# EasyEDA Pro project AquaEye = 2025-10-07.epro

# Schematic Schematic
Board Name: ESP32-C3 - Proteção Gemini; Create Date: 2025-09-07; Page Name: 1x TPS2553; Project Name: AquaEye-Novo; Schematic Name: Schematic-ProtGemini; Update Date: 2025-10-05; Company: EasyEDA.com; Drawn: EasyEDA; Page Size: A4; Part Number: JLCPCB-002; Reviewed: EasyEDA; Version: V0.1
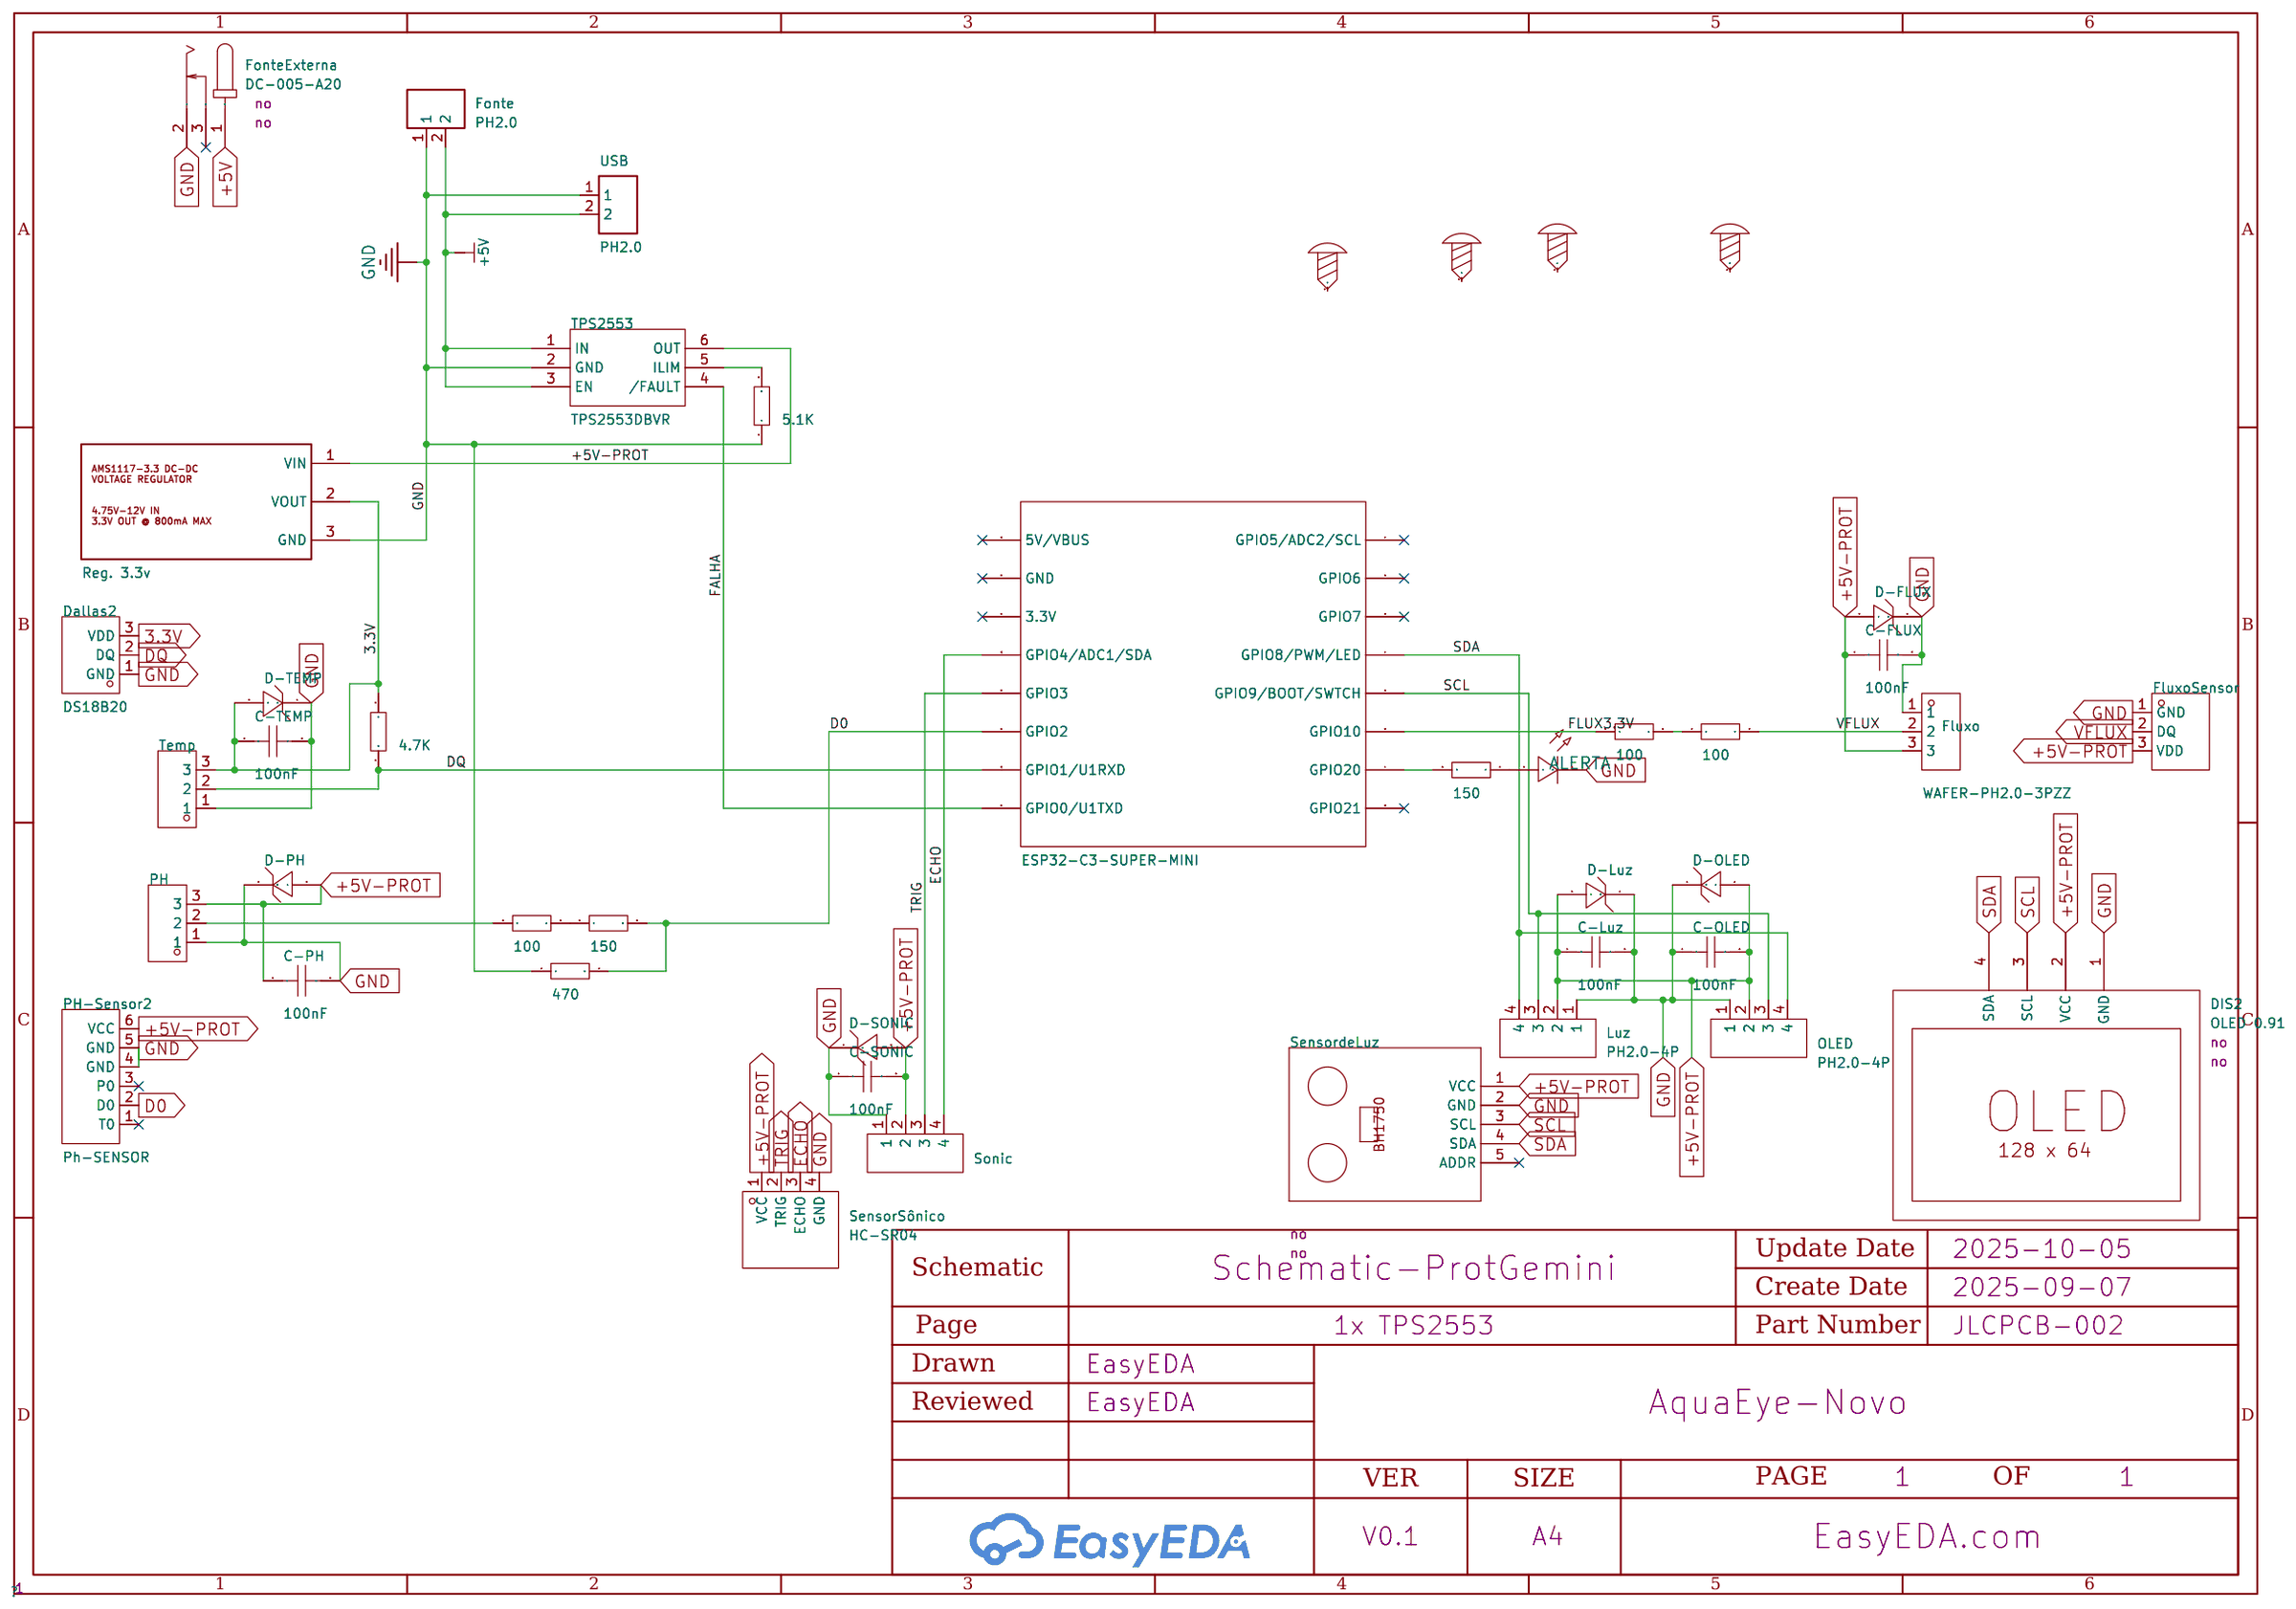
[diagram p0: schematic sheet]

## Parts
ALERTA  -  [LED0805-R-RD]
C-FLUX  100nF  [CAP-TH_L6.5-W4.0-P5.00-D0.6-S1.20]
C-Luz  100nF  [CAP-TH_L6.5-W4.0-P5.00-D0.6-S1.20]
C-OLED  100nF  [CAP-TH_L6.5-W4.0-P5.00-D0.6-S1.20]
C-PH  100nF  [CAP-TH_L6.5-W4.0-P5.00-D0.6-S1.20]
C-SONIC  100nF  [CAP-TH_L6.5-W4.0-P5.00-D0.6-S1.20]
C-TEMP  100nF  [CAP-TH_L6.5-W4.0-P5.00-D0.6-S1.20]
D-FLUX  SMAJ5.0A  [SMA_L4.3-W2.6-LS5.2-RD]
D-Luz  SMAJ5.0A  [SMA_L4.3-W2.6-LS5.2-RD]
D-OLED  SMAJ5.0A  [SMA_L4.3-W2.6-LS5.2-RD]
D-PH  SMAJ5.0A  [SMA_L4.3-W2.6-LS5.2-RD]
D-SONIC  SMAJ5.0A  [SMA_L4.3-W2.6-LS5.2-RD]
D-TEMP  SMAJ5.0A  [SMA_L4.3-W2.6-LS5.2-RD]
Dallas2  DS18B20  [TO-92-3_L4.9-W3.7-P1.27-L]  (no BOM)
DIS2  OLED 0.91  [I2C OLED 0.91]  (no BOM)
Fluxo  WAFER-PH2.0-3PZZ  [CONN-TH_PH2.0D-L-3P]
FluxoSensor  DS18B20A10T6  [TO-92-SMD_L4.6-W4.6-P1.27_DS18B20]  (no BOM)
Fonte  PH2.0  [CONN-TH_WAFER-PH2.0-2PZZ-Y62]
FonteExterna  DC-005-A20  [DC-IN-TH_DC-005-A200]  (no BOM)
Luz  PH2.0-4P  [CONN-TH_PH2.0-4P]
M1  Reg. 3.3v  [AMS1117-3.3 BUCK CONVERTER BREAKOUT]
OLED  PH2.0-4P  [CONN-TH_PH2.0-4P]
PH  WAFER-PH2.0-3PZZ  [CONN-TH_PH2.0D-L-3P]
PH-Sensor2  Ph-SENSOR  [PHSENSOR]  (no BOM)
R5  100  [R0603]
R7  100  [R0603]
R8  150  [R0603]
R9  470  [R0603]
R10  100  [R0603]
SCREW1  -  [Screw-Hole-M2]
SCREW2  -  [Screw-Hole-M2]
SCREW3  -  [Screw-Hole-M2]
SCREW4  -  [Screw-Hole-M2]
SensordeLuz  -  [LIGHT-SENSOR-BH1750]  (no BOM)
SensorSônico  HC-SR04  [TH_HC-SR04V]  (no BOM)
Sonic  PH2.0-4P  [CONN-TH_PH2.0-4P]
Temp  WAFER-PH2.0-3PZZ  [CONN-TH_PH2.0D-L-3P]
TPS2553  TPS2553DBVR  [SOT-23-6_L2.9-W1.6-P0.95-LS2.8-BR]
U1  4.7K  [R0603]
U2  ESP32-C3-SUPER-MINI  [ESP32-C3-SUPER-MINI]
U3  5.1K  [R0603]
U4  150  [R0603]
USB  PH2.0  [CONN-TH_WAFER-PH2.0-2PZZ-Y62]

## Library data of the parts
ALERTA = LED_0805-R: Supplier Footprint: 0805
C-FLUX C-Luz C-OLED C-PH C-SONIC C-TEMP = DCS104Z26Y5VF6FJ5A0: Capacitance:100nF Tolerance:-20%~+80% Tolerance:-20%~+80% Voltage Rating:50V Pin Spacing:5mm Temperature Coefficient:Y5V; LCSC Part Name: 100nF -20%~+80% 50V; Supplier Part: C2896071; Manufacturer: SHM(南方宏明); Supplier Footprint: 插件,P=5mm; JLCPCB Part Class: Extended Part; Datasheet: https://item.szlcsc.com/datasheet/DCS104Z26Y5VF6FJ5A0/3138620.html; Supplier: LCSC; Tolerance: -20%~+80%; Voltage Rating: 50V; Pin Spacing: 5mm; Temperature Coefficient: Y5V
D-FLUX D-Luz D-OLED D-PH D-SONIC D-TEMP = SMAJ5.0A: Reverse Stand-Off Voltage (Vrwm):5V Maximum Clamping Voltage:9.2V Peak Pulse Current (Ipp)@10/1000us:43.5A Breakdown Voltage:6.4V Type:TVS; LCSC Part Name: 单向TVS 5V截止 43.5A峰值脉冲; Supplier Part: C132575; Supplier Footprint: SMA(DO-214AC); Datasheet: https://atta.szlcsc.com/upload/public/pdf/source/20180726/C236400_045E05B60F075B360360EE470465B436.pdf; Supplier: LCSC; Reverse Stand-Off Voltage (Vrwm): 5V; Maximum Clamping Voltage: 9.2V; Peak Pulse Current (Ipp)@10/1000us: 43.5A; Breakdown Voltage: 6.4V; Type: TVS
Dallas2 = DS18B20: Temperature range:-55℃~+125℃ Temperature range:-55℃~+125℃ Resolution:±0.4℃ Resolution:±0.4℃ Supply Voltage:3V~5.5V Supply Voltage:3V~5.5V Standby Current:- Interface Type:-; Supplier Part: C376006; Manufacturer: UMW(友台半导体); Supplier Footprint: TO-92; JLCPCB Part Class: Extended Part; Datasheet: https://atta.szlcsc.com/upload/public/pdf/source/20231109/DC3DA9D47D486EF40A6E0F08B9A498E3.pdf; Supplier: LCSC; Temperature range: -55℃~+125℃; Resolution: ±0.4℃; Supply Voltage: 3V~5.5V; Check: false
DIS2 = OLED 0.91: Manufacturer Part: SSD1306 I2C OLED
Fluxo Temp = WAFER-PH2.0-3PZZ: Pins Structure:1x3P Pitch:2mm Mounting Type:Direct Insert Reference Series:PH Number of Pins:3P Number of Rows:1 Number of PINs Per Row:3 Row Spacing:- Current Rating:2A Contact Material:Brass Contact Plating:Tin Operating Temperature:-25℃~+85℃ Operating; Manufacturer: XUNPU(讯普); Supplier: LCSC; Supplier Part: C5359600; LCSC Part Name: 1x3P 间距:2mm 直插 系列:PH; Supplier Footprint: 插件,P=2mm; JLCPCB Part Class: Extended Part; Datasheet: https://atta.szlcsc.com/upload/public/pdf/source/20241108/09B74E94153224768C62B7F095CB8C18.pdf; Pins Structure: 1x3P; Pitch: 2mm; Mounting Type: Direct Insert; Reference Series: PH; Number of Pins: 3P; Number of Rows: 1; Number of PINs Per Row: 3; Current Rating: 2A; Contact Material: Brass; Contact Plating: Tin; Operating Temperature: -25℃~+85℃; Voltage Rating: 250V; Plastic Material: PA66; Flame Retardant Rating: UL94V-0; Color: White; Z-Height of the Board: 6.05mm; X-Length of Bottom Edge on Board (Spacing Line): 8mm; Y-Width of Bottom Edge on Board: 4.7mm
FluxoSensor = DS18B20A10T6: Temperature range:-55℃~+125℃ Temperature range:-55℃~+125℃ Resolution:±0.5℃ Resolution:±0.5℃ Supply Voltage:1.8V~5.5V Supply Voltage:1.8V~5.5V Standby Current:0.2uA Interface Type:-; LCSC Part Name: 数字温度探头; Supplier Part: C22360667; Manufacturer: Mysentech(敏源传感); JLCPCB Part Class: Extended Part; Datasheet: https://atta.szlcsc.com/upload/public/pdf/source/20240403/8816A34B1D539D1E85165E3122908D9D.pdf; Supplier: LCSC; Temperature range: -55℃~+125℃; Resolution: ±0.5℃; Supply Voltage: 1.8V~5.5V; Standby Current: 0.2uA; Check: false
Fonte USB = PH2.0: Supplier: LCSC; Supplier Part: C42441157; Manufacturer: XUNPU(讯普); Manufacturer Part: WAFER-PH2.0-2PZZ-Y62
FonteExterna = DC-005-A20: Connector Type:DC Power Receptacle Mounting Style:- Inside Contact Diameter:2mm Outside Contact Diameter:6.4mm Current Rating (Max):- Voltage Rating (Max):- Contact Material:- Contact Plating:- Operating Temperature Range:- Operating Temperature Range:- S; LCSC Part Name: DC电源插座 内径:2mm 外径:6.4mm; Supplier Part: C19077752; Manufacturer: Yuandi(元迪); Supplier Footprint: 插件; JLCPCB Part Class: Extended Part; Datasheet: https://atta.szlcsc.com/upload/public/pdf/source/20231020/7887492F275154E63F689B1C5AE32492.pdf; Supplier: LCSC; Connector Type: DC Power Receptacle; Inside Contact Diameter: 2mm; Outside Contact Diameter: 6.4mm
Luz OLED Sonic = PH2.0-4P: Supplier: LCSC; Supplier Part: C722763; Manufacturer: CAX(创都); JLCPCB Part Class: Extended Part
M1 = AMS1117-3.3 DC-DC Voltage Regulator: Supplier: DollaTek on Amazon; link: https://www.amazon.co.uk/gp/product/B07PQPGMZ2/ref=ppx_yo_dt_b_asin_image_o01_s00?ie=UTF8&psc=1
PH = WAFER-PH2.0-3PZZ: Pins Structure:1x3P Pitch:2mm Mounting Type:Direct Insert Reference Series:PH Number of Pins:3P Number of Rows:1 Number of PINs Per Row:3 Row Spacing:- Current Rating:2A Contact Material:Brass Contact Plating:Tin Operating Temperature:-25℃~+85℃ Operating; Manufacturer: XUNPU(讯普); Supplier: LCSC; Supplier Part: C5359600; LCSC Part Name: 1x3P 间距:2mm 直插 系列:PH; Supplier Footprint: 插件,P=2mm; JLCPCB Part Class: Extended Part; Datasheet: https://atta.szlcsc.com/upload/public/pdf/source/20241108/09B74E94153224768C62B7F095CB8C18.pdf; Pins Structure: 1x3P; Pitch: 2mm; Mounting Type: Direct Insert; Number of Pins: 3P; Number of Rows: 1; Number of PINs Per Row: 3; Current Rating: 2A; Contact Material: Brass; Contact Plating: Tin; Operating Temperature: -25℃~+85℃; Voltage Rating: 250V; Plastic Material: PA66; Flame Retardant Rating: UL94V-0; Color: White; Z-Height of the Board: 6.05mm; X-Length of Bottom Edge on Board (Spacing Line): 8mm; Y-Width of Bottom Edge on Board: 4.7mm
PH-Sensor2 = Ph-SENSOR: Check: false
R5 R10 U1 U3 U4 = Res_0603: Supplier Footprint: 0603
R7-R9 = Res_0603: Supplier Footprint: 0603; Check: false
SCREW1-SCREW4 = Screw-Hole-M2: Supplier Footprint: 插件
SensordeLuz = LIGHT-SENSOR-BH1750_
SensorSônico = HC-SR04: Supplier Part: C19857336; Manufacturer: Universal Microelectronics; JLCPCB Part Class: Extended Part; Datasheet: https://atta.szlcsc.com/upload/public/pdf/source/20240122/47B8E374E428935B7962A2189EF91AAC.pdf; Supplier: LCSC; Check: false
TPS2553 = TPS2553DBVR: Type:High-side switch Number of Channels:1 Control Input Logic:Active High Output Current:1.5A Voltage - Supply:2.5V~6.5V Voltage - Supply:2.5V~6.5V RDS(on):85mΩ Operating Temperature	-:-40℃~+150℃ Operating Temperature	-:-40℃~+150℃; LCSC Part Name: 精密可调限流电源分配开关; Supplier Part: C55266; Manufacturer: TI(德州仪器); Supplier Footprint: SOT-23-6; JLCPCB Part Class: Extended Part; Datasheet: https://www.ti.com/cn/lit/gpn/tps2553; Supplier: LCSC; Type: High-side switch; Number of Channels: 1; Control Input Logic: Active High; Output Current: 1.5A; Voltage - Supply: 2.5V~6.5V; RDS(on): 85mΩ; Operating Temperature	-: -40℃~+150℃
U2 = ESP32-C3-SUPER-MINI: Manufacturer: Maker go; link: https://www.tindie.com/products/adz1122/esp32-c3-development-board-esp32-supermini/

## Nets
3.3V: C-TEMP.1 D-TEMP.2(A) Dallas2.3(VDD) M1.2(VOUT) Temp.3 U1.2
+5V: Fonte.2 FonteExterna.1 TPS2553.1(IN) TPS2553.3(EN) USB.2
+5V-PROT: C-FLUX.1 C-Luz.1 C-OLED.2 C-PH.1 C-SONIC.2 D-FLUX.2(A) D-Luz.2(A) D-OLED.2(A) D-PH.2(A) D-SONIC.2(A) DIS2.2(VCC) Fluxo.3 FluxoSensor.3(VDD) Luz.2 M1.1(VIN) OLED.2 PH.3 PH-Sensor2.6(VCC) SensordeLuz.1(VCC) SensorSônico.1(VCC) Sonic.2 TPS2553.6(OUT)
GND: ALERTA.2(C) C-FLUX.2 C-Luz.2 C-OLED.1 C-PH.2 C-SONIC.1 C-TEMP.2 D-FLUX.1(C) D-Luz.1(C) D-OLED.1(C) D-PH.1(C) D-SONIC.1(C) D-TEMP.1(C) Dallas2.1(GND) DIS2.1(GND) Fluxo.1 FluxoSensor.1(GND) Fonte.1 FonteExterna.2 Luz.1 M1.3(GND) OLED.1 PH.1 PH-Sensor2.4(GND) PH-Sensor2.5(GND) R9.1 SensordeLuz.2(GND) SensorSônico.4(GND) Sonic.1 Temp.1 TPS2553.2(GND) U3.1 USB.1
D0: PH-Sensor2.2(D0) R8.2 R9.2 U2.11(GPIO2)
DQ: Dallas2.2(DQ) Temp.2 U1.1 U2.10(GPIO1/U1RXD)
ECHO: SensorSônico.3(ECHO) Sonic.4 U2.13(GPIO4/ADC1/SDA)
FALHA: TPS2553.4(/FAULT) U2.9(GPIO0/U1TXD)
FLUX3.3V: R5.1 U2.6(GPIO10)
SCL: DIS2.3(SCL) Luz.3 OLED.3 SensordeLuz.3(SCL) U2.5(GPIO9/BOOT/SWTCH)
SDA: DIS2.4(SDA) Luz.4 OLED.4 SensordeLuz.4(SDA) U2.4(GPIO8/PWM/LED)
TRIG: SensorSônico.2(TRIG) Sonic.3 U2.12(GPIO3)
VFLUX: Fluxo.2 FluxoSensor.2(DQ) R10.2
$2N1692: R7.2 R8.1
$2N3634: PH.2 R7.1
$2N15099: U2.7(GPIO20) U4.2
$2N15124: ALERTA.1(A) U4.1
$2N15188: R5.2 R10.1
$2N18276: TPS2553.5(ILIM) U3.2

Not connected (* = marked no-connect by the designer): FonteExterna 3*; PH-Sensor2 1(T0)* 3(P0)*; SCREW1 1; SCREW2 1; SCREW3 1; SCREW4 1; SensordeLuz 5(ADDR)*; U2 1(GPIO5/ADC2/SCL)* 2(GPIO6)* 3(GPIO7)* 8(GPIO21)* 14(3.3V)* 15(GND)* 16(5V/VBUS)*

# Board PCB
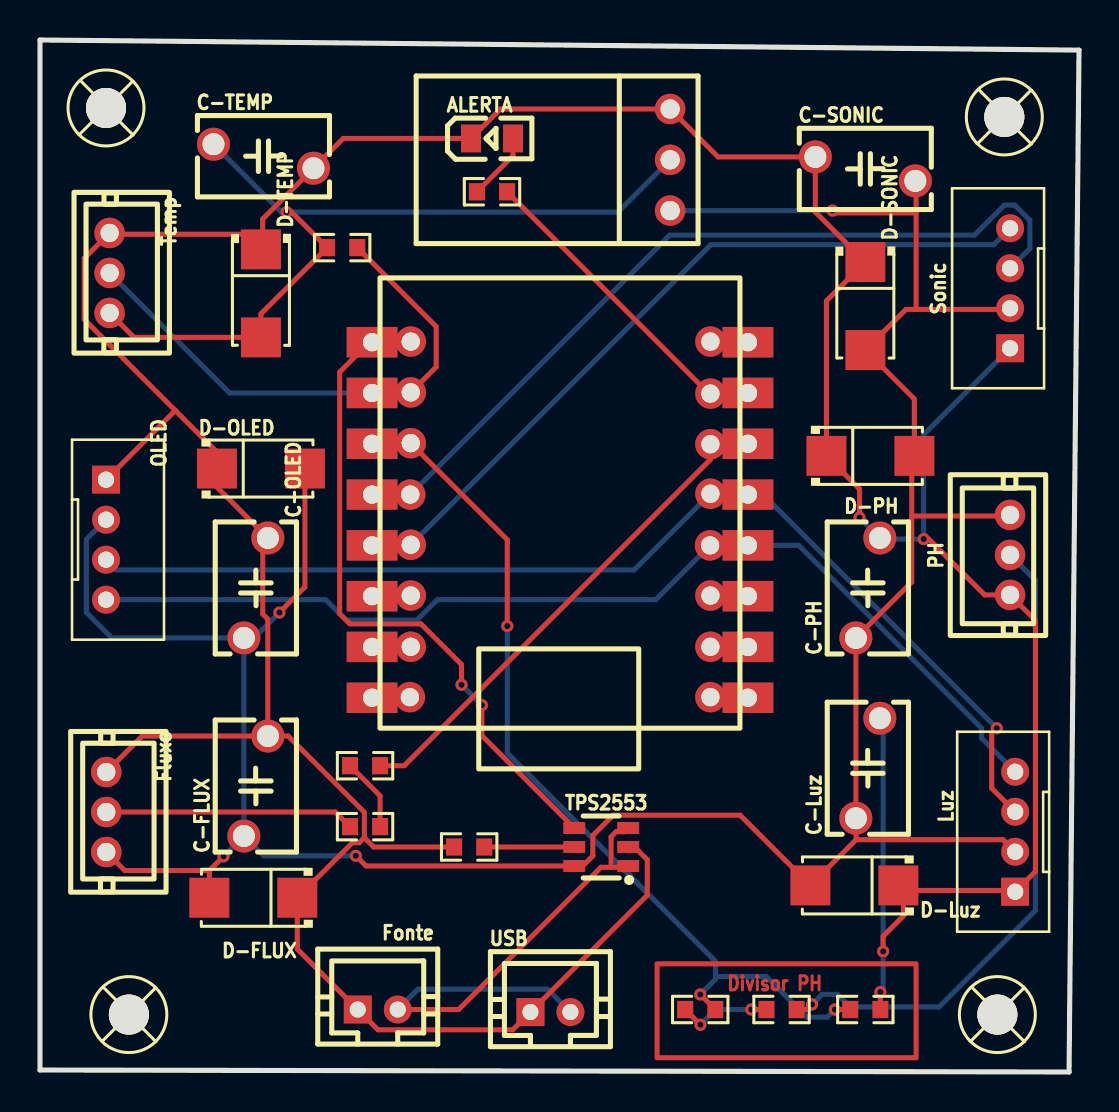
[diagram p1: board, top side]
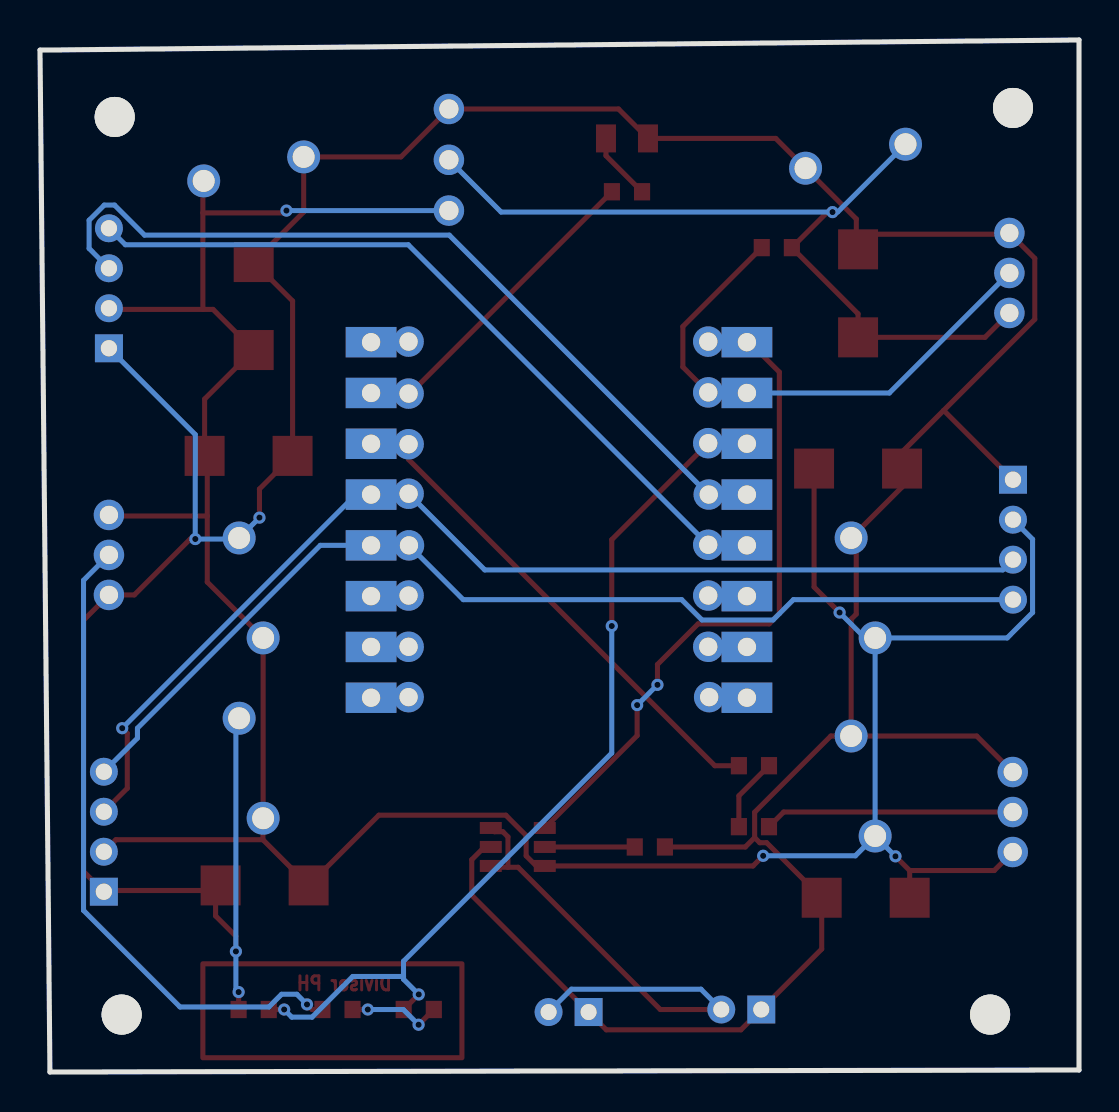
[diagram p2: board, bottom side, seen from below]

Outline 51.96 x 51.61 mm; copper layers: Top Layer, Bottom Layer. Coordinates in mm from the lower left corner of the outline.
Outline path: 0,51.61 51.96,51.1 51.46,0 0,0.1 0,51.61
Stack: Top Layer 0.035mm / Dielectric1 1.51mm FR4 er 4.5 / Bottom Layer 0.035mm

## Design rules (mm)
template: JLCPCB Capability(Two Layers Board)
spacing copperThickness1oz (default): track to track 0.102, other pairs 0.152 to 0.3
spacing copperThickness2oz: track to track 0.203, other pairs 0.152 to 0.3
track width copperThickness1oz (default): min 0.127, default 0.254, max 2.54
track width copperThickness2oz: min 0.203, default 0.254, max 2.54
differential pair differentialPair (default): width min 0.127, default 0.254, max 2.54; gap min 0.152, default 0.152
via viaSize (default): diameter min 0.5, default 0.61, max 10; hole min 0.3, default 0.305, max 6.3

## Placement (name value [footprint] x y rotation side)
ALERTA  -  [LED0805-R-RD]  22.61 46.69 0 top
C-FLUX  100nF  [CAP-TH_L6.5-W4.0-P5.00-D0.6-S1.20]  10.8 14.3 90 top
C-Luz  100nF  [CAP-TH_L6.5-W4.0-P5.00-D0.6-S1.20]  41.4 15.19 90 top
C-OLED  100nF  [CAP-TH_L6.5-W4.0-P5.00-D0.6-S1.20]  10.8 24.21 270 top
C-PH  100nF  [CAP-TH_L6.5-W4.0-P5.00-D0.6-S1.20]  41.4 24.21 90 top
C-SONIC  100nF  [CAP-TH_L6.5-W4.0-P5.00-D0.6-S1.20]  41.28 45.16 0 top
C-TEMP  100nF  [CAP-TH_L6.5-W4.0-P5.00-D0.6-S1.20]  11.18 45.8 0 top
D-FLUX  SMAJ5.0A  [SMA_L4.3-W2.6-LS5.2-RD]  10.67 8.71 180 top
D-Luz  SMAJ5.0A  [SMA_L4.3-W2.6-LS5.2-RD]  40.73 9.33 180 top
D-OLED  SMAJ5.0A  [SMA_L4.3-W2.6-LS5.2-RD]  11.05 30.18 0 top
D-PH  SMAJ5.0A  [SMA_L4.3-W2.6-LS5.2-RD]  41.53 30.81 0 top
D-SONIC  SMAJ5.0A  [SMA_L4.3-W2.6-LS5.2-RD]  41.28 38.3 270 top
D-TEMP  SMAJ5.0A  [SMA_L4.3-W2.6-LS5.2-RD]  11.05 38.94 270 top
Fluxo  WAFER-PH2.0-3PZZ  [CONN-TH_PH2.0D-L-3P]  3.31 13 270 top
Fonte  PH2.0  [CONN-TH_WAFER-PH2.0-2PZZ-Y62]  16.89 3.13 0 top
Luz  PH2.0-4P  [CONN-TH_PH2.0-4P]  48.77 12.02 90 top
M1  Reg. 3.3v  [AMS1117-3.3 BUCK CONVERTER BREAKOUT]  28.97 45.62 90 top
NOREF  -  [Pad_e1553]  18.54 33.99 0 top
NOREF#2  -  [Pad_e1568]  33.51 26.34 0 top
NOREF#3  -  [Pad_e1564]  33.53 36.53 0 top
NOREF#4  -  [Pad_e1562]  18.54 23.83 0 top
NOREF#5  -  [Pad_e1567]  33.53 28.92 0 top
NOREF#6  -  [Pad_e1551]  18.54 36.53 0 top
NOREF#7  -  [Pad_e1578]  18.5 18.75 0 top
NOREF#8  -  [Pad_e1577]  33.53 18.75 0 top
NOREF#9  -  [Pad_e1574]  33.53 23.83 0 top
NOREF#10  -  [Pad_e1561]  18.54 26.37 0 top
NOREF#11  -  [Pad_e1565]  33.53 33.93 0 top
NOREF#12  -  [Pad_e1575]  33.53 21.26 0 top
NOREF#13  -  [Pad_e1566]  33.53 31.39 0 top
NOREF#14  -  [Pad_e1563]  18.54 21.26 0 top
NOREF#15  -  [Pad_e1555]  18.52 28.88 0 top
NOREF#16  -  [Pad_e1554]  18.54 31.45 0 top
OLED  PH2.0-4P  [CONN-TH_PH2.0-4P]  3.3 26.62 270 top
PH  WAFER-PH2.0-3PZZ  [CONN-TH_PH2.0D-L-3P]  48.51 25.86 90 top
R5  100  [R0603]  16.26 15.32 180 top
R7  100  [R0603]  37.08 3.13 180 top
R8  150  [R0603]  33.02 3.13 0 top
R9  470  [R0603]  41.28 3.13 180 top
R10  100  [R0603]  16.26 12.27 180 top
SCREW1  -  [Screw-Hole-M2]  48.23 47.76 0 top
SCREW2  -  [Screw-Hole-M2]  47.88 2.87 0 top
SCREW3  -  [Screw-Hole-M2]  4.45 2.87 0 top
SCREW4  -  [Screw-Hole-M2]  3.3 48.21 0 top
Sonic  PH2.0-4P  [CONN-TH_PH2.0-4P]  48.51 39.19 90 top
Temp  WAFER-PH2.0-3PZZ  [CONN-TH_PH2.0D-L-3P]  3.48 39.96 270 top
TPS2553  TPS2553DBVR  [SOT-23-6_L2.9-W1.6-P0.95-LS2.8-BR]  28.07 11.25 0 top
U1  4.7K  [R0603]  15.11 41.23 180 top
U2  -  [ESP32-C3-SUPER-MINI]  26.01 26.84 180 top
U3  5.1K  [R0603]  21.46 11.25 0 top
U4  150  [R0603]  22.61 44.02 0 top
USB  PH2.0  [CONN-TH_WAFER-PH2.0-2PZZ-Y62]  25.53 3 0 top

## Footprints (pads in the part's own frame, mm; a bottom-side part is the same pattern mirrored in y, then rotated)
AMS1117-3.3 BUCK CONVERTER BREAKOUT
  round 1.524 hole 0.965: 1(-2.54,-2.54) 2(0,-2.54) 3(2.54,-2.54)
CAP-TH_L6.5-W4.0-P5.00-D0.6-S1.20
  round 1.65 hole 1.1: 1(-2.5,0.6) 2(2.5,-0.6)
CONN-TH_PH2.0-4P
  rect 1.4x1.4 hole 0.813: 1(-3,0)
  round 1.4 hole 0.813: 2(-1,0) 3(1,0) 4(3,0)
CONN-TH_PH2.0D-L-3P
  round 1.524 hole 0.914: 1(-2,0) 2(0,0) 3(2,0)
CONN-TH_WAFER-PH2.0-2PZZ-Y62
  rect 1.4x1.4 hole 0.8: 1(-1,0)
  round 1.4 hole 0.8: 2(1,0)
ESP32-C3-SUPER-MINI
  rect 2.54x1.524 hole 0.914: 1(-9.398,8.128) 2(-9.398,5.588) 3(-9.398,3.048) 4(-9.398,0.508) 5(-9.398,-2.032) 6(-9.398,-4.572) 7(-9.398,-7.112) 8(-9.398,-9.652) 9(9.398,-9.652) 10(9.398,-7.112) 11(9.398,-4.572) 12(9.398,-2.032) 13(9.398,0.508) 14(9.398,3.048) 15(9.398,5.588) 16(9.398,8.128)
LED0805-R-RD
  rect 1x1.399 smd: 1(1.05,0) 2(-1.05,0)
Pad_e1551
  round 1.524 hole 0.914: 1(0,0)
Pad_e1553
  round 1.524 hole 0.914: 1(0,0)
Pad_e1554
  round 1.524 hole 0.914: 2(0,0)
Pad_e1555
  round 1.524 hole 0.914: 3(0,0)
Pad_e1561
  round 1.524 hole 0.914: 4(0,0)
Pad_e1562
  round 1.524 hole 0.914: 5(0,0)
Pad_e1563
  round 1.524 hole 0.914: 6(0,0)
Pad_e1564
  round 1.524 hole 0.914: 7(0,0)
Pad_e1565
  round 1.524 hole 0.914: 8(0,0)
Pad_e1566
  round 1.524 hole 0.914: 9(0,0)
Pad_e1567
  round 1.524 hole 0.914: 10(0,0)
Pad_e1568
  round 1.524 hole 0.914: 11(0,0)
Pad_e1574
  round 1.524 hole 0.914: 12(0,0)
Pad_e1575
  round 1.524 hole 0.914: 13(0,0)
Pad_e1577
  round 1.524 hole 0.914: 1(0,0)
Pad_e1578
  round 1.524 hole 0.914: 2(0,0)
R0603
  rect 0.806x0.864 smd: 1(-0.753,0) 2(0.753,0)
Screw-Hole-M2
  round 2 hole 2: 1(0,0)
SMA_L4.3-W2.6-LS5.2-RD
  rect 2x2 smd: 1(-2.2,0) 2(2.2,0)
SOT-23-6_L2.9-W1.6-P0.95-LS2.8-BR
  rect 1.1x0.6 smd: 1(1.35,-0.95) 2(1.35,0) 3(1.35,0.95) 4(-1.35,0.95) 5(-1.35,0) 6(-1.35,-0.95)

## Nets
3.3V: C-TEMP.1 D-TEMP.2 M1.2 Temp.3 U1.2
+5V: Fonte.2 TPS2553.1 TPS2553.3 USB.2
+5V-PROT: C-FLUX.1 C-Luz.1 C-OLED.2 C-PH.1 C-SONIC.2 D-FLUX.2 D-Luz.2 D-OLED.2 D-PH.2 D-SONIC.2 Fluxo.3 Luz.2 M1.1 OLED.2 PH.3 Sonic.2 TPS2553.6
GND: ALERTA.2 C-FLUX.2 C-Luz.2 C-OLED.1 C-PH.2 C-SONIC.1 C-TEMP.2 D-FLUX.1 D-Luz.1 D-OLED.1 D-PH.1 D-SONIC.1 D-TEMP.1 Fluxo.1 Fonte.1 Luz.1 M1.3 OLED.1 PH.1 R9.1 Sonic.1 Temp.1 TPS2553.2 U3.1 USB.1
D0: NOREF#16.2 R8.2 R9.2 U2.11
DQ: NOREF.1 Temp.2 U1.1 U2.10
ECHO: NOREF#10.4 Sonic.4 U2.13
FALHA: NOREF#6.1 TPS2553.4 U2.9
FLUX3.3V: NOREF#13.9 R5.1 U2.6
SCL: Luz.3 NOREF#5.10 OLED.3 U2.5
SDA: Luz.4 NOREF#2.11 OLED.4 U2.4
TRIG: NOREF#15.3 Sonic.3 U2.12
VFLUX: Fluxo.2 R10.2
$2N1692: R7.2 R8.1
$2N3634: PH.2 R7.1
$2N15099: NOREF#11.8 U2.7 U4.2
$2N15124: ALERTA.1 U4.1
$2N15188: R5.2 R10.1
$2N18276: TPS2553.5 U3.2

Pads without a net: NOREF#3 7; NOREF#4 5; NOREF#7 2; NOREF#8 1; NOREF#9 12; NOREF#12 13; NOREF#14 6; SCREW1 1; SCREW2 1; SCREW3 1; SCREW4 1; U2 1 2 3 8 14 15 16

## Via types
v1: diameter 0.61, hole 0.305, Top Layer to Bottom Layer, 18 vias

## Routing (per net, layer and track width the routed paths; a pad name or vN(x,y) marks a point on that pad's centre or on a via; arc(x,y) is an arc through that point)
3.3V: length 42
  Top Layer w0.254: Temp.3 4.7,36.74 D-TEMP.2 11.05,37.91 U1.2 12.58,43 v1(12.33,43)
  Bottom Layer w0.254: C-TEMP.1 12.07,43 v1(12.33,43) 28.9,43 M1.2
+5V: length 26.6
  Top Layer w0.254: 28.56,10.24 28.05,10.24 20.94,3.13 Fonte.2 ; 28.56,10.24 29.35,10.24 TPS2553.1 ; 28.56,10.24 28.56,11.76 28.81,12.02 29.23,12.02 TPS2553.3
  Bottom Layer w0.254: Fonte.2 18.91,4.14 25.38,4.14 USB.2
+5V-PROT: length 144.8
  Top Layer w0.254: D-OLED.2 13.25,24.25 v1(11.97,22.98) ; 40.81,11.62 48.17,11.62 Luz.2 ; 40.81,11.62 40.81,12.68 C-Luz.1 C-PH.1 43.6,24.5 43.6,27.8 ; 40.81,11.62 D-Luz.2 35.01,12.84 28.66,12.84 27.65,11.83 27.65,10.81 27.14,10.3 TPS2553.6 16.3,10.3 v1(15.8,10.81) ; 43.81,38.14 43.81,42.96 ; 43.81,38.14 48.46,38.14 Sonic.2 ; 43.81,38.14 43.31,38.14 D-SONIC.2 43.73,33.65 43.73,30.81 43.6,30.68 43.6,27.8 ; 43.81,42.96 43.81,44.52 C-SONIC.2 ; 43.81,42.96 39.75,42.96 v1(39.64,43.08) ; PH.3 48.46,27.8 43.6,27.8 ; 8.47,10.07 D-FLUX.2 ; 8.47,10.07 v1(9.18,10.79) ; 8.47,10.07 4.24,10.07 3.31,11
  Bottom Layer w0.254: OLED.2 2.32,26.64 2.32,22.98 3.59,21.71 10.19,21.71 ; 10.19,21.71 10.7,21.71 v1(11.97,22.98) ; 10.19,21.71 10.19,11.8 ; 10.19,11.8 v1(9.18,10.79) ; 10.19,11.8 11.19,10.81 v1(15.8,10.81) ; v1(39.64,43.08) M1.1
GND: length 209
  Top Layer w0.254: C-FLUX.2 11.4,22.64 11.14,22.9 11.14,26.45 C-OLED.1 8.85,29.25 D-OLED.1 8.85,31 6.78,33.07 ; C-FLUX.2 12.41,16.8 16.22,12.99 16.22,11.72 ; C-FLUX.2 5.12,16.8 Fluxo.1 ; 11.14,41.9 11.14,41.23 D-TEMP.1 ; 11.14,41.9 11.14,42.66 C-TEMP.2 15.16,46.69 ALERTA.2 23.03,48.16 M1.3 33.91,45.76 C-SONIC.1 38.78,43 D-SONIC.1 39.33,38.56 D-PH.1 40.99,29.15 v1(40.99,27.72) ; 11.14,41.9 3.55,41.9 Temp.1 2.21,40.69 2.21,37.64 6.78,33.07 ; 43.18,9.08 43.18,7.81 42.16,6.79 v1(42.16,6.03) ; 43.18,9.08 48.71,9.08 Luz.1 49.78,10.03 49.78,22.59 PH.1 47.24,23.86 44.45,26.65 v1(44.2,26.65) ; 43.18,9.08 D-Luz.1 ; OLED.1 6.75,33.07 6.78,33.07 ; v1(42.03,4) R9.1 ; 16.22,11.72 16.69,11.25 U3.1 ; 16.22,11.72 15.97,11.47 15.62,11.47 D-FLUX.1 12.87,6.15 Fonte.1 16.91,2.11 23.64,2.11 USB.1 30.37,8.84 30.37,10.62 29.73,11.25 TPS2553.2
  Bottom Layer w0.254: Sonic.1 44.2,31.88 v1(44.2,26.65) 42.06,26.65 C-PH.2 v1(40.99,27.72) ; C-Luz.2 42.16,17.53 v1(42.16,6.03) 42.16,4.13 v1(42.03,4)
D0: length 44.9
  Top Layer w0.254: NOREF#16.2 23.37,26.62 v1(23.37,22.3) ; v1(33.02,3.88) R8.2 ; v1(39.75,3.13) R9.2
  Bottom Layer w0.254: 33.78,4.78 33.78,4.64 v1(33.02,3.88) ; 33.78,4.78 33.78,5.54 23.37,15.95 v1(23.37,22.3) ; 33.78,4.78 36.32,4.78 38.35,2.74 39.37,2.74 v1(39.75,3.13) ; U2.11 16.64,31.45 NOREF#16.2
DQ: length 27
  Top Layer w0.254: NOREF.1 19.81,35.26 19.81,37.28 U1.1
  Bottom Layer w0.254: Temp.2 9.48,33.96 U2.10 16.64,33.99 NOREF.1
ECHO: length 38.5
  Bottom Layer w0.254: Sonic.4 47.69,41.37 33.55,41.37 NOREF#10.4 16.64,26.37 U2.13
FALHA: length 35.9
  Top Layer w0.254: TPS2553.4 22.1,16.82 v1(22.1,18.35) ; v1(21.08,19.36) 21.08,20.38 19.05,22.41 15.49,22.41 14.99,22.92 14.99,35 16.51,36.53 NOREF#6.1
  Bottom Layer w0.254: v1(21.08,19.36) v1(22.1,18.35) ; U2.9 16.64,36.53 NOREF#6.1
FLUX3.3V: length 25.5
  Top Layer w0.254: NOREF#13.9 33.53,30.63 18.21,15.32 R5.1
  Bottom Layer w0.254: NOREF#13.9 35.38,31.39 U2.6
SCL: length 56
  Top Layer w0.254: Luz.3 47.6,14.19 47.6,16.94 v1(47.85,17.19)
  Bottom Layer w0.254: v1(47.85,17.19) 36.17,28.88 U2.5 35.36,28.92 NOREF#5.10 29.72,25.11 3.81,25.11 OLED.3
SDA: length 52.4
  Bottom Layer w0.254: OLED.4 14.28,23.62 15.3,22.6 18.86,22.6 19.87,23.62 30.79,23.62 NOREF#2.11 U2.4 37.94,26.34 47.09,17.19 47.09,16.7 Luz.4
TRIG: length 42
  Bottom Layer w0.254: U2.12 NOREF#15.3 31.49,41.85 46.73,41.85 48.24,43.36 48.74,43.36 49.51,42.59 49.51,41.19 Sonic.3
VFLUX: length 12.5
  Top Layer w0.254: Fluxo.2 14.77,13 R10.2
$2N1692: length 4.7
  Top Layer w0.254: R7.2 v1(35.57,3.13) ; v1(33.03,2.36) R8.1
  Bottom Layer w0.254: v1(35.57,3.13) 33.79,3.13 v1(33.03,2.36)
$2N3634: length 32.8
  Top Layer w0.254: R7.1 38.35,3.13 v1(38.61,3.38)
  Bottom Layer w0.254: PH.2 49.78,24.59 49.78,8.08 44.96,3.25 40.51,3.25 39.88,3.89 39.12,3.89 v1(38.61,3.38)
$2N15099: length 16.2
  Top Layer w0.254: U4.2 33.45,33.93 NOREF#11.8
  Bottom Layer w0.254: NOREF#11.8 35.37,33.93 U2.7
$2N15124: length 3.4
  Top Layer w0.254: ALERTA.1 23.66,45.82 U4.1
$2N15188: length 3.7
  Top Layer w0.254: R5.2 17.01,13.81 R10.1
$2N18276: length 4.5
  Top Layer w0.254: TPS2553.5 U3.2

## Text on the board
Top Layer: Divisor PH
